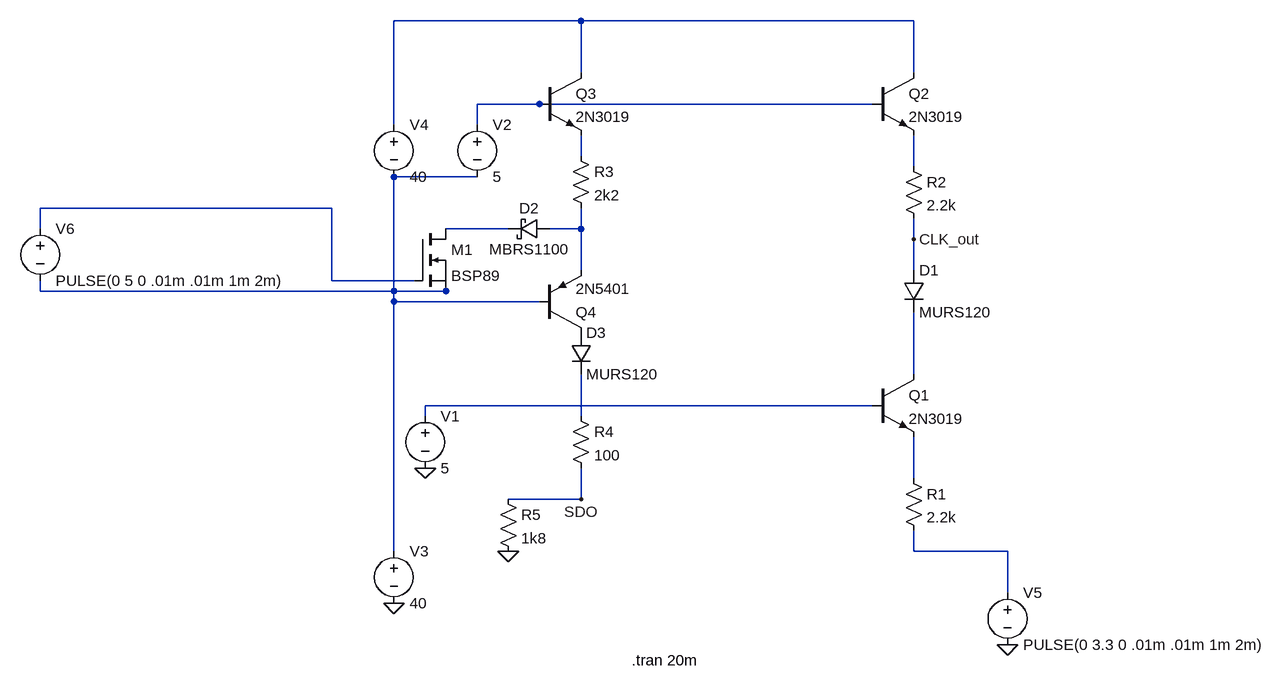
[diagram p0: schematic daisyChainLTC6802-2.asc]
daisyChainLTC6802-2.asc, the LTspice schematic file:
Version 4
SHEET 1 880 680
WIRE -192 -416 -480 -416
WIRE 320 -416 -192 -416
WIRE -192 -336 -192 -416
WIRE 320 -336 320 -416
WIRE -256 -288 -352 -288
WIRE 256 -288 -256 -288
WIRE -480 -256 -480 -416
WIRE -352 -256 -352 -288
WIRE -192 -208 -192 -240
WIRE 320 -192 320 -240
WIRE -352 -176 -480 -176
WIRE -576 -128 -1024 -128
WIRE -1024 -96 -1024 -128
WIRE -304 -96 -400 -96
WIRE -192 -96 -192 -128
WIRE -192 -96 -240 -96
WIRE 320 -80 320 -112
WIRE -192 -32 -192 -96
WIRE 320 -32 320 -80
WIRE -576 -16 -576 -128
WIRE -448 -16 -576 -16
WIRE -1024 0 -1024 -16
WIRE -480 0 -480 -176
WIRE -480 0 -1024 0
WIRE -400 0 -400 -16
WIRE -400 0 -480 0
WIRE -480 16 -480 0
WIRE -256 16 -480 16
WIRE 320 128 320 32
WIRE 256 176 -432 176
WIRE -432 192 -432 176
WIRE -192 192 -192 128
WIRE 320 288 320 224
WIRE -192 320 -192 272
WIRE -192 320 -304 320
WIRE -480 400 -480 16
WIRE 320 400 320 368
WIRE 464 400 320 400
WIRE 464 464 464 400
FLAG -432 272 0
FLAG -480 480 0
FLAG 464 544 0
FLAG -304 400 0
FLAG 320 -80 CLK_out
FLAG -192 320 SDO
SYMBOL npn 256 128 R0
SYMATTR InstName Q1
SYMATTR Value 2N3019
SYMBOL res 304 272 R0
SYMATTR InstName R1
SYMATTR Value 2.2k
SYMBOL diode 304 -32 R0
SYMATTR InstName D1
SYMATTR Value MURS120
SYMBOL voltage -432 176 R0
WINDOW 123 0 0 Left 0
WINDOW 39 0 0 Left 0
SYMATTR InstName V1
SYMATTR Value 5
SYMBOL npn 256 -336 R0
SYMATTR InstName Q2
SYMATTR Value 2N3019
SYMBOL res 304 -208 R0
SYMATTR InstName R2
SYMATTR Value 2.2k
SYMBOL voltage -352 -272 R0
WINDOW 123 0 0 Left 0
WINDOW 39 0 0 Left 0
SYMATTR InstName V2
SYMATTR Value 5
SYMBOL voltage -480 384 R0
WINDOW 123 0 0 Left 0
WINDOW 39 0 0 Left 0
SYMATTR InstName V3
SYMATTR Value 40
SYMBOL voltage -480 -272 R0
WINDOW 123 0 0 Left 0
WINDOW 39 0 0 Left 0
SYMATTR InstName V4
SYMATTR Value 40
SYMBOL voltage 464 448 R0
WINDOW 123 0 0 Left 0
WINDOW 39 0 0 Left 0
SYMATTR InstName V5
SYMATTR Value PULSE(0 3.3 0 .01m .01m 1m 2m)
SYMBOL npn -256 -336 R0
SYMATTR InstName Q3
SYMATTR Value 2N3019
SYMBOL res -208 -224 R0
SYMATTR InstName R3
SYMATTR Value 2k2
SYMBOL voltage -1024 -112 R0
WINDOW 123 0 0 Left 0
WINDOW 39 0 0 Left 0
SYMATTR InstName V6
SYMATTR Value PULSE(0 5 0 .01m .01m 1m 2m)
SYMBOL schottky -240 -112 R90
WINDOW 0 0 32 VBottom 2
WINDOW 3 32 32 VTop 2
SYMATTR InstName D2
SYMATTR Value MBRS1100
SYMATTR Description Diode
SYMATTR Type diode
SYMBOL pnp -256 64 M180
SYMATTR InstName Q4
SYMATTR Value 2N5401
SYMBOL diode -208 64 R0
SYMATTR InstName D3
SYMATTR Value MURS120
SYMBOL res -208 176 R0
SYMATTR InstName R4
SYMATTR Value 100
SYMBOL res -320 304 R0
SYMATTR InstName R5
SYMATTR Value 1k8
SYMBOL nmos -448 -96 R0
SYMATTR InstName M1
SYMATTR Value BSP89
TEXT -114 568 Left 2 !.tran 20m

The netlist it stands for:
* daisyChainLTC6802-2.asc
Q1 N009 N010 N012 0 2N3019
R1 N012 N013 2.2k
D1 CLK_out N009 MURS120
V1 N010 0 5
Q2 N001 N002 N004 0 2N3019
R2 N004 CLK_out 2.2k
V2 N002 N005 5
V3 N005 0 40
V4 N001 N005 40
V5 N013 0 PULSE(0 3.3 0 .01m .01m 1m 2m)
Q3 N001 N002 N003 0 2N3019
R3 N003 N008 2k2
V6 N006 N005 PULSE(0 5 0 .01m .01m 1m 2m)
D2 N008 N007 MBRS1100
Q4 P001 N005 N008 0 2N5401
D3 P001 N011 MURS120
R4 N011 SDO 100
R5 SDO 0 1k8
M1 N007 N006 N005 N005 BSP89
.model D D
.lib standard.dio
.model NPN NPN
.model PNP PNP
.lib standard.bjt
.model NMOS NMOS
.model PMOS PMOS
.lib standard.mos
.tran 20m
.backanno
.end